# EAGLE design untitled (EAGLE 9.6.2)
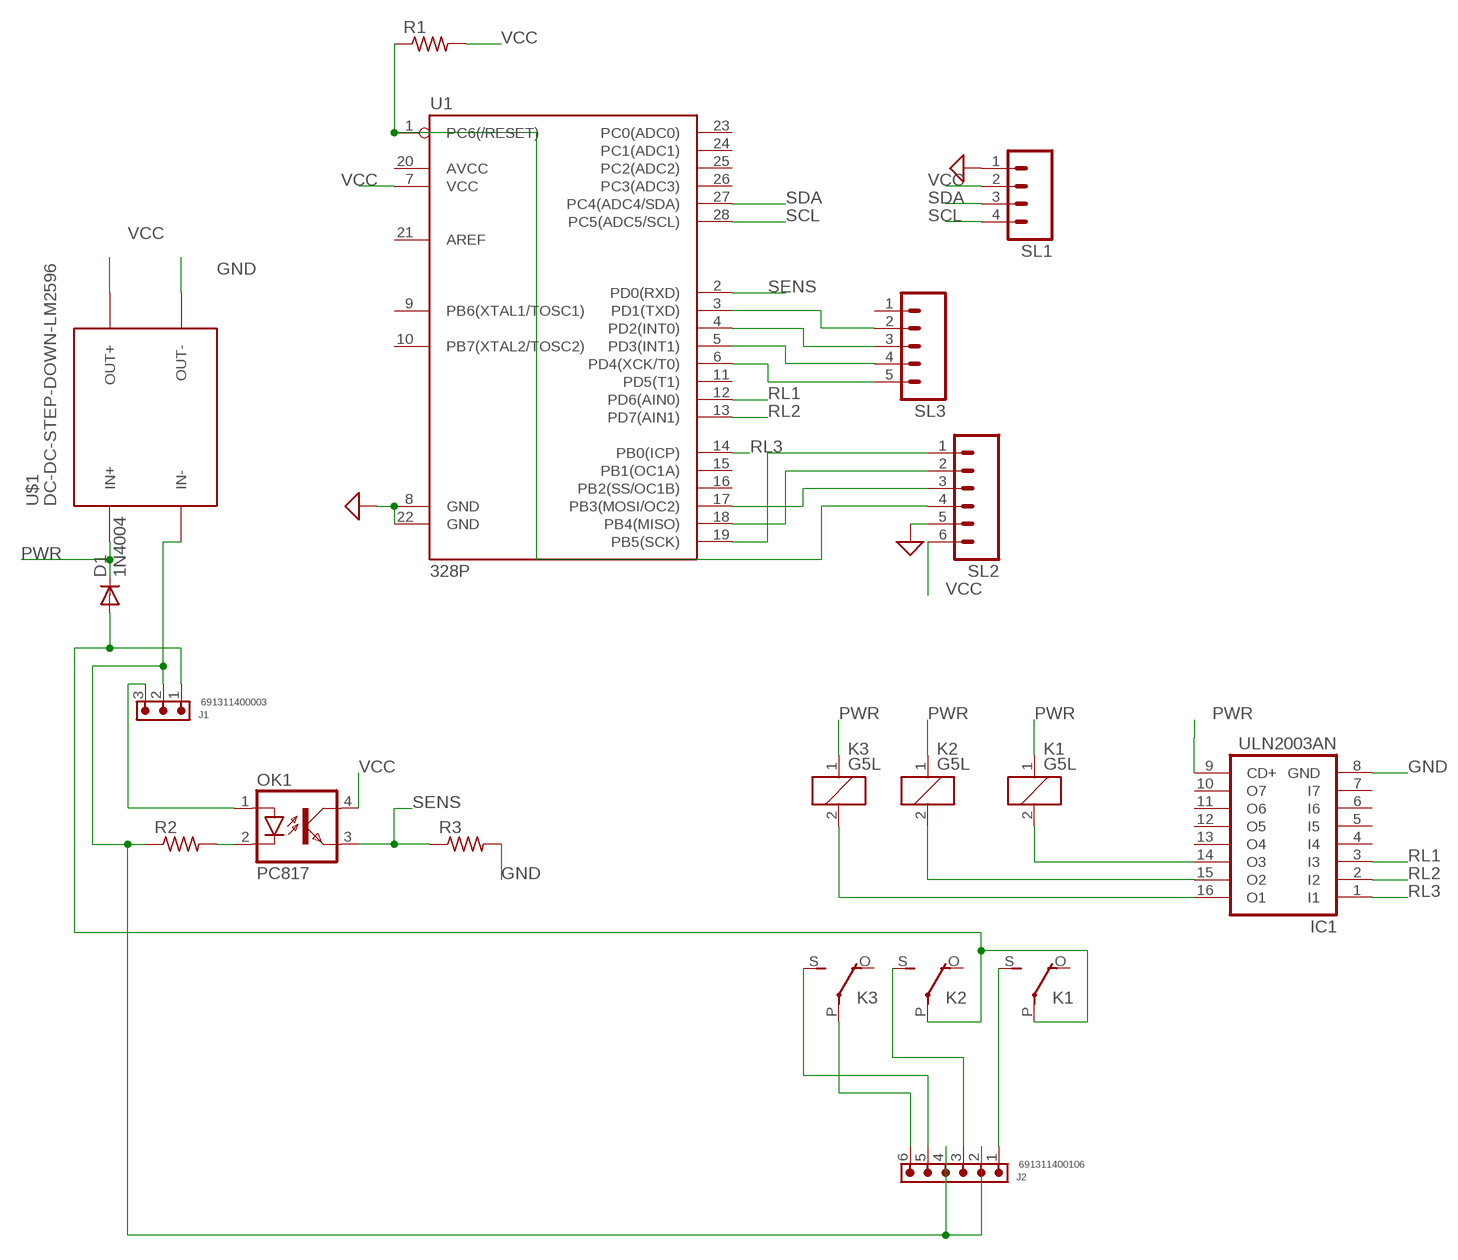
[diagram p0: schematic, sheet 1]

## Parts
D1  1N4004  [DO41-10]
IC1  ULN2003AN  [DIL16]
J1  691311400003  691311400003  [691311400003]
J2  691311400106  691311400106  [691311400106]
K1  G5L  [G5LE]
K2  G5L  [G5LE]
K3  G5L  [G5LE]
OK1  PC817  [DIL04]
R1  R-US_0207/7  [0207/7]
R2  R-US_0207/7  [0207/7]
R3  R-US_0207/7  [0207/7]
SL1  M04  [04P]
SL2  M06  [06P]
SL3  M05  [05P]
U1  328P  ATMEGA328P_PDIP  [DIP28]
U$1  DC-DC-STEP-DOWN-LM2596  [DC-DC-STEP-DOWN-LM2596]

## Nets
GND: IC1.8(GND) R3.2 SL1.1 SL2.5 U1.8(GND) U1.22(GND) U$1.OUT- ; supply symbol labelled SUP
N$1: J2.1 K1.S(2:S)
N$2: D1.A J1.1 K1.P(2:P) K2.P(2:P)
N$3: J1.3 OK1.1(A)
N$4: SL2.1 U1.19(PB5(SCK))
N$5: SL2.2 U1.18(PB4(MISO))
N$6: SL2.3 U1.17(PB3(MOSI/OC2))
N$7: R1.1 SL2.4 U1.1(PC6(/RESET))
N$8: OK1.2(C) R2.2
N$9: J2.3 K2.S(2:S)
N$10: SL3.2 U1.3(PD1(TXD))
N$11: J2.5 K3.S(2:S)
N$12: J2.6 K3.P(2:P)
N$13: IC1.14(O3) K1.2
N$14: IC1.15(O2) K2.2
N$15: IC1.16(O1) K3.2
N$16: J1.2 J2.2 J2.4 R2.1 U$1.IN-
N$17: SL3.3 U1.4(PD2(INT0))
N$18: SL3.4 U1.5(PD3(INT1))
N$19: SL3.5 U1.6(PD4(XCK/T0))
PWR: D1.C IC1.9(CD+) K1.1 K2.1 K3.1 U$1.IN+
RL1: IC1.3(I3) U1.12(PD6(AIN0))
RL2: IC1.2(I2) U1.13(PD7(AIN1))
RL3: IC1.1(I1) U1.14(PB0(ICP))
SCL: SL1.4 U1.28(PC5(ADC5/SCL))
SDA: SL1.3 U1.27(PC4(ADC4/SDA))
SENS: OK1.3(EMIT) R3.1 U1.2(PD0(RXD))
VCC: OK1.4(COL) R1.2 SL1.2 SL2.6 U1.7(VCC) U$1.OUT+
Unconnected: IC1.4(I4) IC1.5(I5) IC1.6(I6) IC1.7(I7) IC1.10(O7) IC1.11(O6) IC1.12(O5) IC1.13(O4) K1.O(2:O) K2.O(2:O) K3.O(2:O) SL3.1 U1.9(PB6(XTAL1/TOSC1)) U1.10(PB7(XTAL2/TOSC2)) U1.11(PD5(T1)) U1.15(PB1(OC1A)) U1.16(PB2(SS/OC1B)) U1.20(AVCC) U1.21(AREF) U1.23(PC0(ADC0)) U1.24(PC1(ADC1)) U1.25(PC2(ADC2)) U1.26(PC3(ADC3))

## Library data of the parts
D1 = adafruit:1N4004: DIODE General purpose 1N400x type rectifier (With bigger pads) http://www.ladyada.net/library/pcb/eaglelibrary.html
IC1 = uln-udn:ULN2003A: DRIVER ARRAY
J1 = Wurth_Connectors_WR-TBL Pluggable Connector:691311400003: WR-TBL Serie 3114 - 7.62 mm Open Vertical PCB Header KIND PROPERTIES Pitch 7.62 mm MATERIAL PROPERTIES Insulator Material PBT Insulator Flammability Rating UL94 V-0 Contact Material Brass Contact Plating Tin GENERAL INFORMATION Operating Temperature -40 up to +105 °C Compliance RoHS ELECTRICAL PROPERTIES IR cULus 20 A Working Voltage [cULus] 300 V (AC) Withstanding Voltage [cULus] 1600 V (AC) Contact Resistance [cULus] 20 mΩ CERTIFICATION UL Approval E315414 <https://www.we-online.com/catalog/media/o33255v209%20Family_WR-TBL_69131140000x.jpg> Details see: https://www.we-online.com/catalog/en/TBL_7_62_3114_OPEN_VERTICAL_PCB_HEADER_69131140000X/ Updated by Ella Wu 2019-12-30 2019(C) Wurth Elektronik; DATASHEET-URL: https://www.we-online.com/catalog/datasheet/691311400003.pdf; IR-UL: 20A; MOUNT: THT; PART-NUMBER: 691311400003; PINS: 3; PITCH: 7.62mm; TYPE: Vertical; WORKING-VOLTAGE-UL: 300V (AC)
J2 = Wurth_Connectors_WR-TBL Pluggable Connector:691311400106: WR-TBL Serie 3114 - 7.62 mm Close Vertical PCB Header KIND PROPERTIES Pitch 7.62 mm MATERIAL PROPERTIES Insulator Material PBT Insulator Flammability Rating UL94 V-0 Contact Material Brass Contact Plating Tin GENERAL INFORMATION Operating Temperature -40 up to +105 °C Compliance RoHS ELECTRICAL PROPERTIES IR cULus 20 A Working Voltage [cULus] 300 V (AC) Withstanding Voltage [cULus] 1600 V (AC) Contact Resistance [cULus] 20 mΩ CERTIFICATION UL Approval E315414 <https://www.we-online.com/catalog/media/o33256v209%20Family_WR-TBL_69131140010x.jpg> Details see: https://www.we-online.com/catalog/en/TBL_7_62_3114_CLOSE_VERTICAL_PCB_HEADER_69131140010X/ Updated by Ella Wu 2019-12-30 2019(C) Wurth Elektronik; DATASHEET-URL: https://www.we-online.com/catalog/datasheet/691311400106.pdf; IR-UL: 20A; MOUNT: THT; PART-NUMBER: 691311400106; PINS: 6; PITCH: 7.62mm; TYPE: Vertical; WORKING-VOLTAGE-UL: 300V (AC)
K1-K3 = relay:G5L: RELAY 1 x switch, 10 A/120 V AC, 8 A/30 V ADC, Omron; OC_FARNELL: unknown; OC_NEWARK: unknown
OK1 = optocoupler:PC817: SHARP OPTO COUPLER; MPN: PC817X4J000F; OC_FARNELL: 9707727; OC_NEWARK: 97K7059
R1-R3 = adafruit:R-US_: RESISTOR, American symbol
SL1 = con-amp-quick:M04: AMP QUICK CONNECTOR; OC_FARNELL: unknown; OC_NEWARK: unknown
SL2 = con-amp-quick:M06: AMP QUICK CONNECTOR; OC_FARNELL: unknown; OC_NEWARK: unknown
SL3 = con-amp-quick:M05: AMP QUICK CONNECTOR; OC_FARNELL: unknown; OC_NEWARK: unknown
U1 = SparkFun-IC-Microcontroller:ATMEGA328P_PDIP: Atmel 328P Through hole ATMEGA328P uC used in the Arduino 32kb flash, 1k EEPROM, 2k SRAM Datasheet <http://www.sparkfun.com/datasheets/Components/SMD/ATMega328.pdf> SparkFun Products Storefront component: AVR 28 Pin 20MHz 32K 6A/D - ATMega328P <https://www.sparkfun.com/products/9061> (COM-09061) SparkFun Simon Says - Through-Hole Soldering Kit <https://www.sparkfun.com/products/10547> (KIT-10547) SparkFun Learn to Solder - Simon Says <https://www.sparkfun.com/products/13708> (KIT-13708) SparkFun BigTime Watch Kit <https://www.sparkfun.com/products/11734> (KIT-11734) SparkFun ClockIt <https://www.sparkfun.com/products/10930> (KIT-10930) SparkFun Serial Enabled LCD Kit <https://www.sparkfun.com/products/10097> (LCD-10097) SparkFun Simon Tilts - Through Hole Soldering Kit <https://www.sparkfun.com/products/12634> (KIT-12634) SparkFun Frequency Counter Kit <https://www.sparkfun.com/products/10140> (KIT-10140) FabFM Radio Kit <https://www.sparkfun.com/products/11043> (KIT-11043) SparkFun Binary Blaster Kit <https://www.sparkfun.com/products/12037> (KIT-12037) SparkFun Metro-Gnome <https://www.sparkfun.com/products/9236> (KIT-09236) ATmega328 with Arduino Optiboot (Uno) <https://www.sparkfun.com/products/10524> (DEV-10524); PROD_ID: IC-09136
U$1 = diy-modules:DC-DC-STEP-DOWN-LM2596: DC/DC Step-Down Regulator based on LM2596-ADJ chip LM2596 datasheet available here: http://www.ti.com/lit/ds/symlink/lm2596.pdf Click here to find device on ebay.com <http://www.ebay.com/sch/lm2596+power+regulator>

## Board
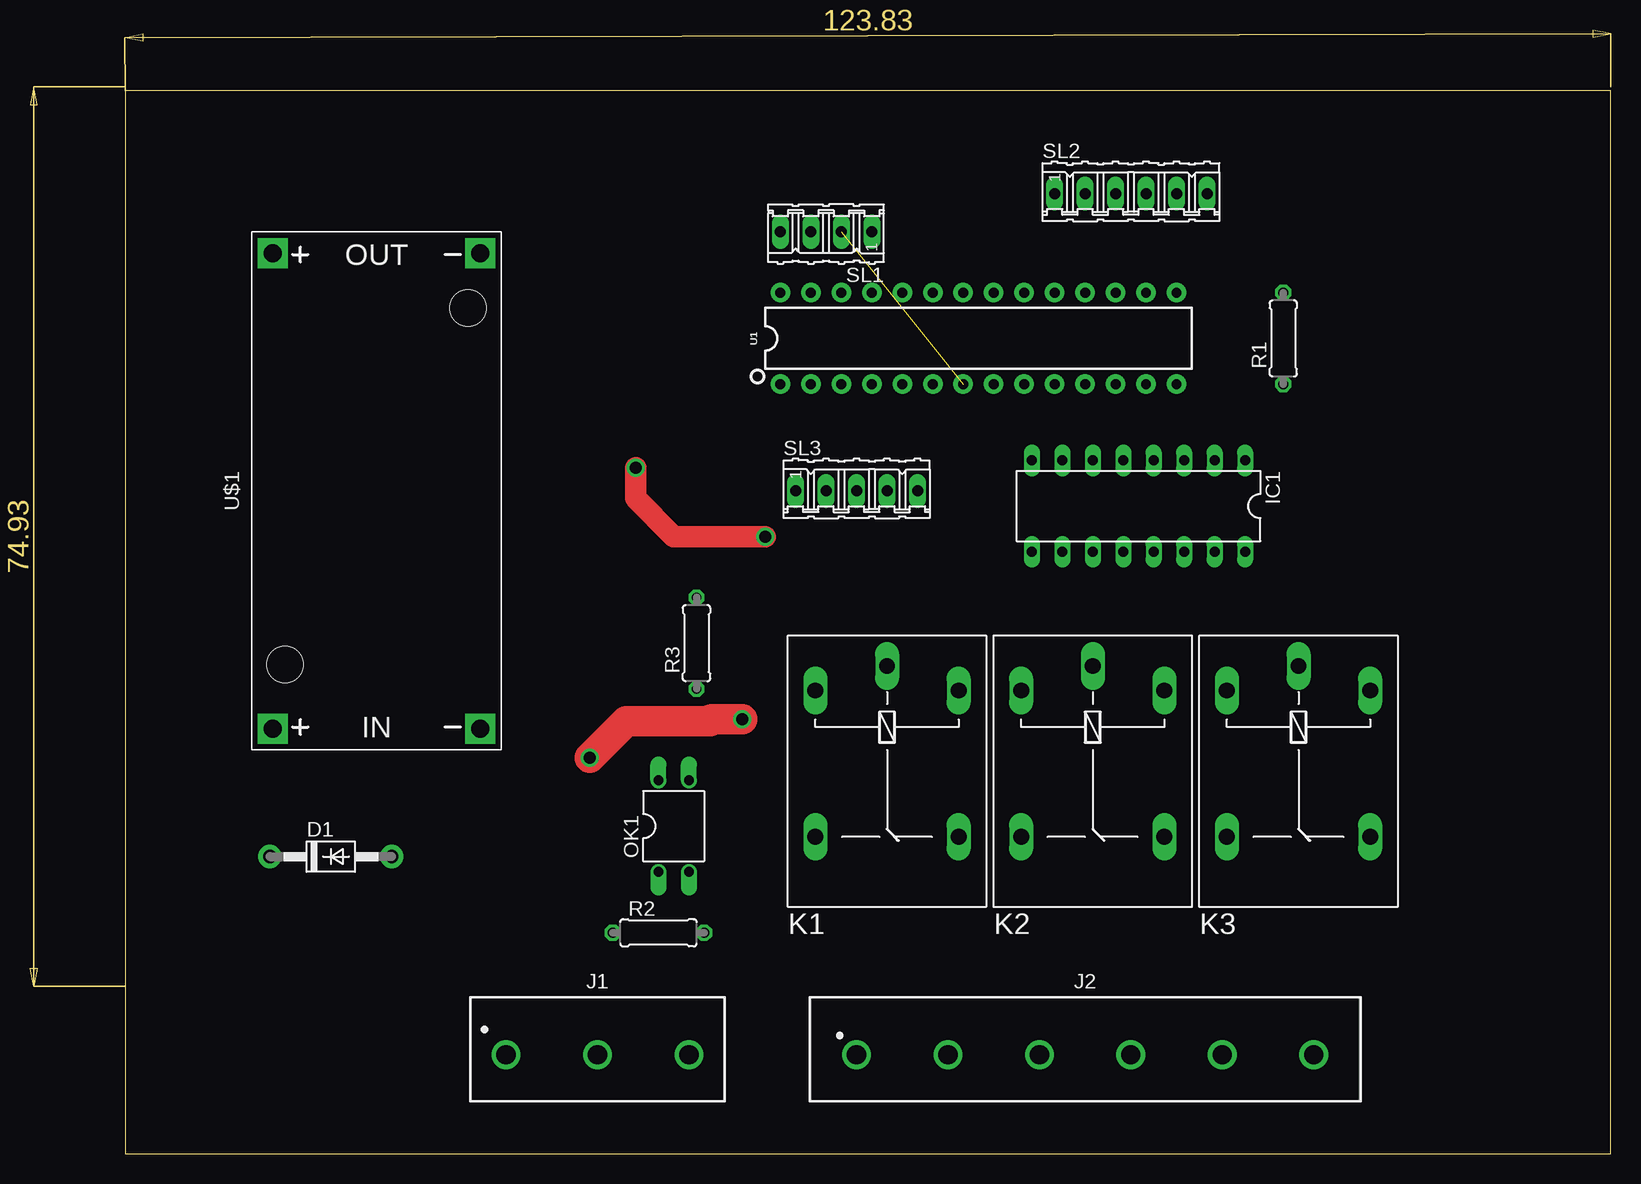
[diagram p1: board, top side]
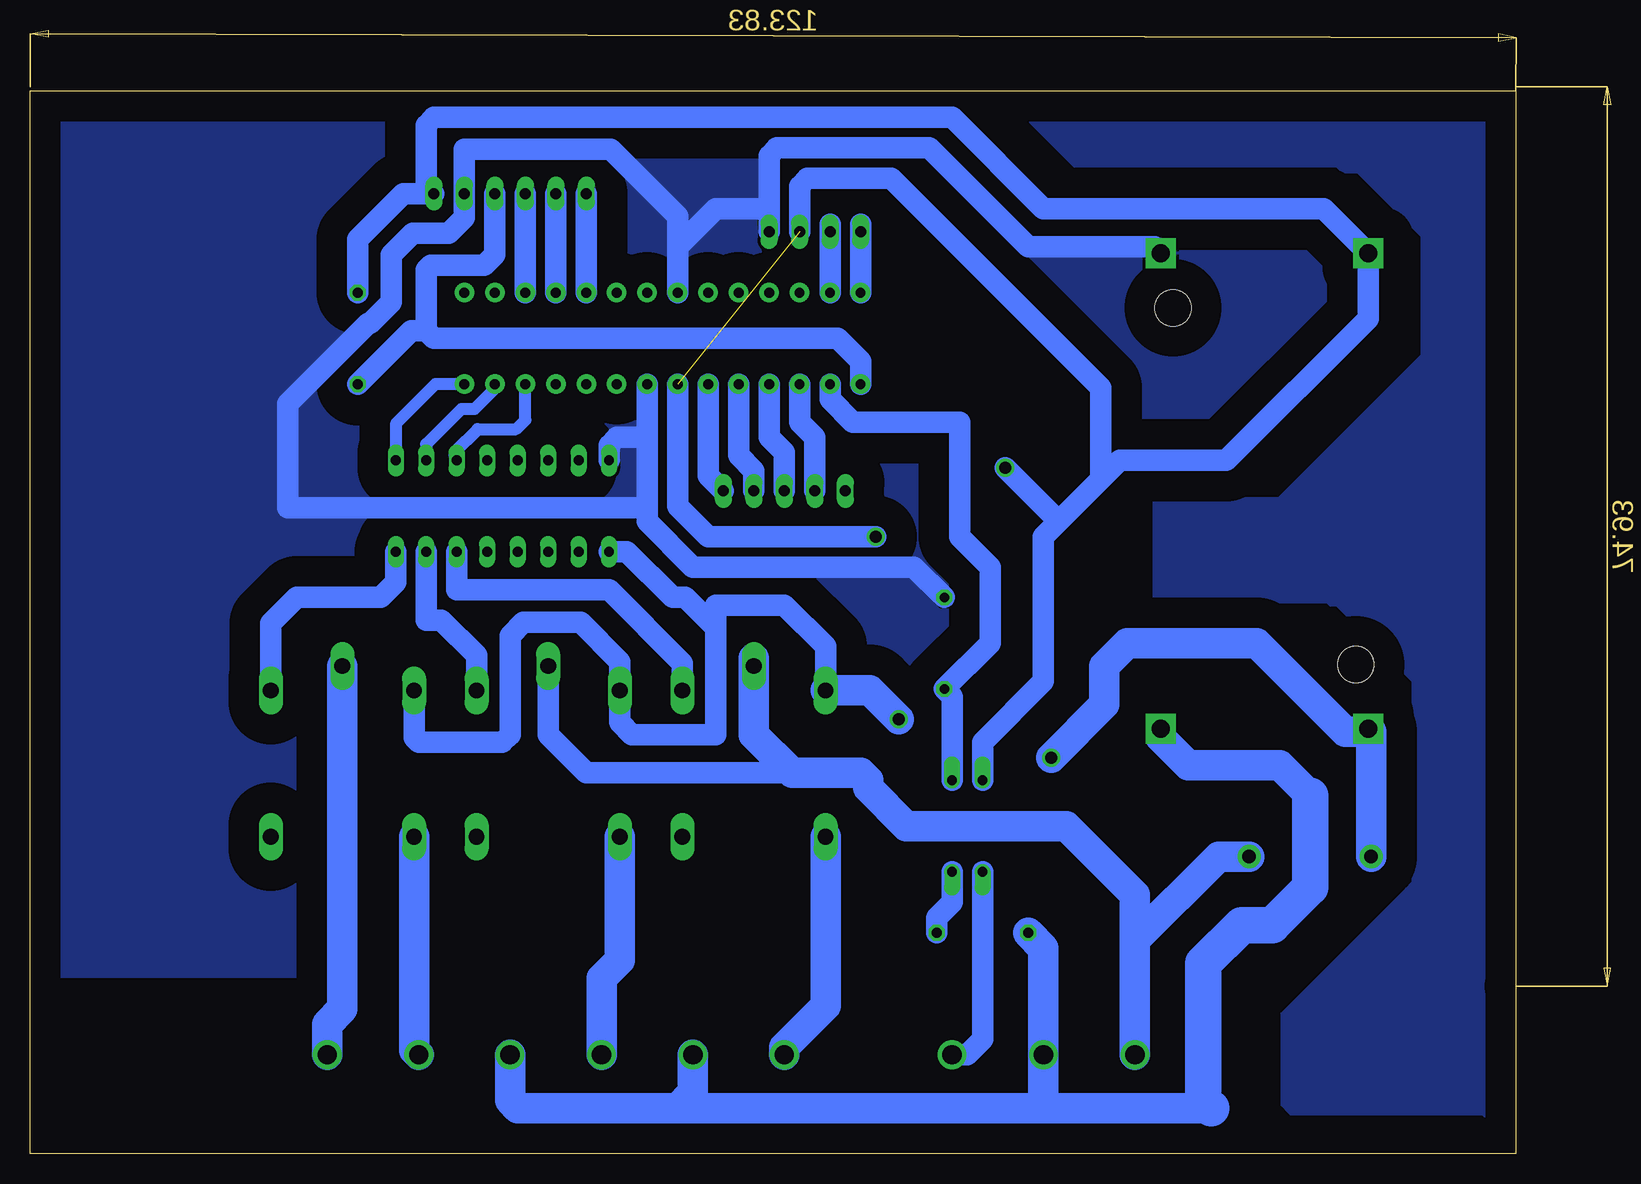
[diagram p2: board, bottom side, seen from below]

Size 123.81 x 88.57 mm. Coordinates in mm from the lower left corner, seen from the top.
Outline: 0,0 123.81,0 123.81,88.57 0,88.57 0,0
Copper layers (1*16): Top 0.035mm / dielectric 1.5mm / Bottom 0.035mm
Design rules "default *": minimum track width 6mil, minimum drill 0.35mm, track to track 30mil, track to pad 30mil, pad to pad 30mil, via to via 30mil, smd to smd 6mil, copper to edge 40mil, drill to drill 6mil, minimum pad ring 10mil, minimum via ring 8mil, stop-mask expansion 4mil, vias tented up to drill 0mil, thermal gap 10mil

### Footprints (pad centres in the part's own frame; a part is rotated, then mirrored left to right if it is on the bottom)
DO41-10 = drill 1.118 pad 1.93: A 5.08,0; C -5.08,0
DIL16 = drill 0.813 long: 1 -8.89,-3.81; 2 -6.35,-3.81; 3 -3.81,-3.81; 4 -1.27,-3.81; 5 1.27,-3.81; 6 3.81,-3.81; 7 6.35,-3.81; 8 8.89,-3.81; 9 8.89,3.81; 10 6.35,3.81; 11 3.81,3.81; 12 1.27,3.81; 13 -1.27,3.81; 14 -3.81,3.81; 15 -6.35,3.81; 16 -8.89,3.81
691311400003 = drill 1.6: 1 -7.62,0; 2 0,0; 3 7.62,0
691311400106 = drill 1.6: 1 -19.05,0; 2 -11.43,0; 3 -3.81,0; 4 3.81,0; 5 11.43,0; 6 19.05,0
G5LE = drill 1.321 long: 1 -7.493,-5.969; 2 -7.493,5.969; O 4.699,5.969; P -9.525,0; S 4.699,-5.969
DIL04 = drill 0.813 offset: 1 -1.27,-3.81; 2 1.27,-3.81; 3 1.27,3.81; 4 -1.27,3.81
0207/7 = drill 0.813 octagon: 1 -3.81,0; 2 3.81,0
04P = drill 0.914 long: 1 -3.81,0; 2 -1.27,0; 3 1.27,0; 4 3.81,0
06P = drill 0.914 long: 1 -6.35,0; 2 -3.81,0; 3 -1.27,0; 4 1.27,0; 5 3.81,0; 6 6.35,0
05P = drill 0.914 long: 1 -5.08,0; 2 -2.54,0; 3 0,0; 4 2.54,0; 5 5.08,0
DIP28 = drill 0.813 pad 1.626: 1 -16.51,-3.81; 2 -13.97,-3.81; 3 -11.43,-3.81; 4 -8.89,-3.81; 5 -6.35,-3.81; 6 -3.81,-3.81; 7 -1.27,-3.81; 8 1.27,-3.81; 9 3.81,-3.81; 10 6.35,-3.81; 11 8.89,-3.81; 12 11.43,-3.81; 13 13.97,-3.81; 14 16.51,-3.81; 15 16.51,3.81; 16 13.97,3.81; 17 11.43,3.81; 18 8.89,3.81; 19 6.35,3.81; 20 3.81,3.81; 21 1.27,3.81; 22 -1.27,3.81; 23 -3.81,3.81; 24 -6.35,3.81; 25 -8.89,3.81; 26 -11.43,3.81; 27 -13.97,3.81; 28 -16.51,3.81
DC-DC-STEP-DOWN-LM2596 = drill 1.5 pad 2.5 square: IN+ -19.812,8.636; IN- -19.812,-8.636; OUT+ 19.812,8.636; OUT- 19.812,-8.636 | hole 3: -14.478,7.62; 15.24,-7.62

### Placement (x,y rotation side)
D1  17.14,24.77 0 top
IC1  84.45,53.98 180 top
J1  39.37,8.26 0 top
J2  80.01,8.26 0 top
K1  63.5,31.12 270 top
K2  80.64,31.12 270 top
K3  97.79,31.12 270 top
OK1  45.72,27.3 0 top
R1  96.52,67.95 90 top
R2  44.45,18.41 0 top
R3  47.62,42.55 90 top
SL1  58.42,76.84 180 top
SL2  83.82,80.01 0 top
SL3  60.96,55.24 0 top
U1  71.12,67.95 0 top
U$1  20.95,55.24 90 top

### Tracks (layer width: path | path; a pad name or v marks a point on that pad's centre or on a via)
GND
  Bottom 1.778: R3.2 50.16,48.89 68.58,48.89 72.39,52.7 72.39,53.85 | 69.85,75.56 69.85,78.11 75.44,83.69 87.63,83.69 SL2.5 87.63,77.99 88.91,76.71 91.95,76.71 93.73,74.93 93.73,70.96 95.47,69.22 95.63,69.22 102.36,62.48 102.36,53.85 72.39,53.85 | 69.85,75.56 U1.22 | SL1.1 62.23,78.74 | 62.23,78.74 62.23,83.19 61.59,83.82 48.9,83.82 40.64,75.56 30.1,75.56 U$1.OUT- | 62.23,78.74 66.67,78.74 69.85,75.56 | U1.8 72.39,59.69 | 72.39,59.69 72.39,53.85 | IC1.8 75.56,59.05 74.93,59.69 72.39,59.69
  pour Bottom (isolate 2.54): 0,88.65 123.19,88.65 123.44,88.39 123.44,14.99 123.7,14.73 0.25,14.73 0.25,88.39
N$1
  Bottom 2.54: K1.S 57.53,12.32 60.96,8.89 J2.1
N$2
  Bottom 1.778: 63.5,41.27 K1.P | K2.P 80.64,34.92 77.47,31.75 60.33,31.75
  Bottom 2.54: J1.1 31.75,17.78 | D1.A 24.77,24.77 31.75,17.78 | 31.75,17.78 31.75,21.59 37.47,27.3 50.8,27.3 53.98,30.48 53.98,31.12 54.61,31.75 60.33,31.75 63.5,34.92 63.5,41.27
N$3
  Bottom 1.778: J1.3 45.72,8.26 44.45,9.53 OK1.1
N$4
  Bottom 1.778: SL2.1 U1.19
N$5
  Bottom 1.778: SL2.2 U1.18
N$6
  Bottom 1.778: SL2.3 U1.17
N$7
  Bottom 1.778: SL2.4 85.09,74.93 85.98,74.04 90.42,74.04 90.81,73.66 90.81,68.58 | 90.81,68.58 90.17,67.95 56.52,67.95 54.61,66.04 U1.1 | R1.1 92.08,68.58 90.81,68.58
N$8
  Bottom 1.778: R2.2 48.26,19.69 46.99,20.96 OK1.2
N$9
  Bottom 2.54: K2.S 74.68,16.13 76.2,14.61 J2.3
N$10
  Bottom 1.778: U1.3 59.69,60.96 58.42,59.69 SL3.2
N$11
  Bottom 2.54: K3.S 91.82,8.64 J2.5
N$12
  Bottom 2.54: K3.P 97.79,12.07 99.06,10.8 J2.6
N$13
  Bottom 1.778: K1.2 69.47,40.89 75.56,46.99 88.27,46.99 IC1.14
N$14
  Bottom 1.778: K2.2 86.61,41.53 89.53,44.45 90.81,44.45 IC1.15
N$15
  Bottom 1.778: K3.2 103.76,44.2 101.6,46.35 94.61,46.35 93.34,47.62 IC1.16
N$16
  Bottom 2.54: J2.4 83.82,4.45 83.19,3.81 69.85,3.81 | 69.85,3.81 68.58,5.08 J2.2 | 69.85,3.81 39.37,3.81 | 39.37,3.81 J1.2 39.37,17.14 R2.1 | 39.37,3.81 25.4,3.81 | 17.14,29.84 19.68,32.38 27.3,32.38 29.59,34.67 U$1.IN-
  Bottom 3.048: 17.14,29.84 17.14,22.23 20.32,19.05 22.86,19.05 26.04,15.88 26.04,4.45 25.4,3.81
N$17
  Bottom 1.778: SL3.3 60.96,58.44 62.23,59.71 U1.4
N$18
  Bottom 1.778: SL3.4 63.5,56.93 64.77,58.2 U1.5
N$19
  Bottom 1.778: U1.6 67.31,56.52 SL3.5
N$20
  pour Bottom (isolate 2.54): 0.25,88.39 41.91,88.39 42.42,87.88 36.83,82.3 14.99,82.3 14.48,81.79 13.21,81.79 9.4,77.98 7.87,76.45 7.87,66.55 19.81,54.61 22.35,54.61 30.23,54.61 30.23,46.23 30.48,45.97 15.75,45.97 15.49,45.72 14.99,45.72 8.64,39.37 8.64,22.61 9.14,22.1 19.56,11.68 19.56,10.92 19.56,4.06 18.8,3.3 5.08,3.3 2.79,3.3 2.29,2.79 2.29,85.34 1.27,86.36 1.27,87.38
PWR  (via drill 1)
  Top 2.54: v51.44,36.2 48.89,36.2 48.74,36.04 41.76,36.04 v38.73,33.02
  Bottom 1.778: K3.1 91.82,34.67 91.44,34.29 84.45,34.29 83.82,34.92 83.82,43.18 82.73,44.27 77.93,44.27 74.68,41.02 K2.1 74.68,35.94 73.66,34.92 66.67,34.92 66.67,43.81 | 66.67,43.81 66.67,45.72 60.96,45.72 57.53,42.29 K1.1 | 66.67,43.81 69.22,46.35 70.27,46.35 74.08,50.16 IC1.9
  Bottom 2.54: D1.C 12.06,35.18 | 12.06,35.18 U$1.IN+ | K1.1 53.85,38.61 v51.44,36.2 | v38.73,33.02 34.29,37.47 34.29,40.64 32.38,42.55 21.59,42.55 14.22,35.18 12.06,35.18
RL1
  Bottom 1.016: IC1.3 88.27,57.99 88.42,58.14 88.42,58.48 86.53,60.38 83.31,60.38 82.55,61.14 U1.12
RL2
  Bottom 1.016: U1.13 85.09,63.75 86.79,62.05 87.88,62.05 90.81,59.13 IC1.2
RL3
  Bottom 1.016: U1.14 90.04,64.14 93.34,60.83 IC1.1
SCL
  Bottom 1.778: U1.28 SL1.4 54.61,77.47
SDA
  Bottom 1.778: U1.27 SL1.3 57.15,77.47
SENS
  Bottom 1.778: OK1.3 46.99,38.1 R3.1 43.81,42.55 43.81,48.89 46.35,51.44 46.35,60.96 55.24,60.96 57.15,62.87 U1.2
VCC  (via drill 1)  (1 unrouted)
  Top 1.778: v53.34,51.44 45.72,51.44 42.55,54.61 v42.55,57.15
  Bottom 1.778: OK1.4 44.45,34.29 39.37,39.37 39.37,51.44 34.61,56.2 | 34.61,56.2 33.02,57.78 24.13,57.78 12.32,69.6 U$1.OUT+ 16,78.74 39.37,78.74 46.99,86.36 90.17,86.36 90.81,85.72 90.81,80.64 SL2.6 92.71,80.01 96.52,76.2 R1.2 | 34.61,56.2 34.61,63.82 52.07,81.28 59.05,81.28 59.69,80.64 SL1.2 | v42.55,57.15 38.73,53.34 | v53.34,51.44 67.31,51.44 69.85,53.98 U1.7